# Altium schematic sheet PI2_Circuit.SchDoc
size Tabloid; Date: Date; Author: Author 1; Revision: 1; SheetNumber: 2; SheetTotal: 3; Size: 11x17; Sheet_Name: Circuit
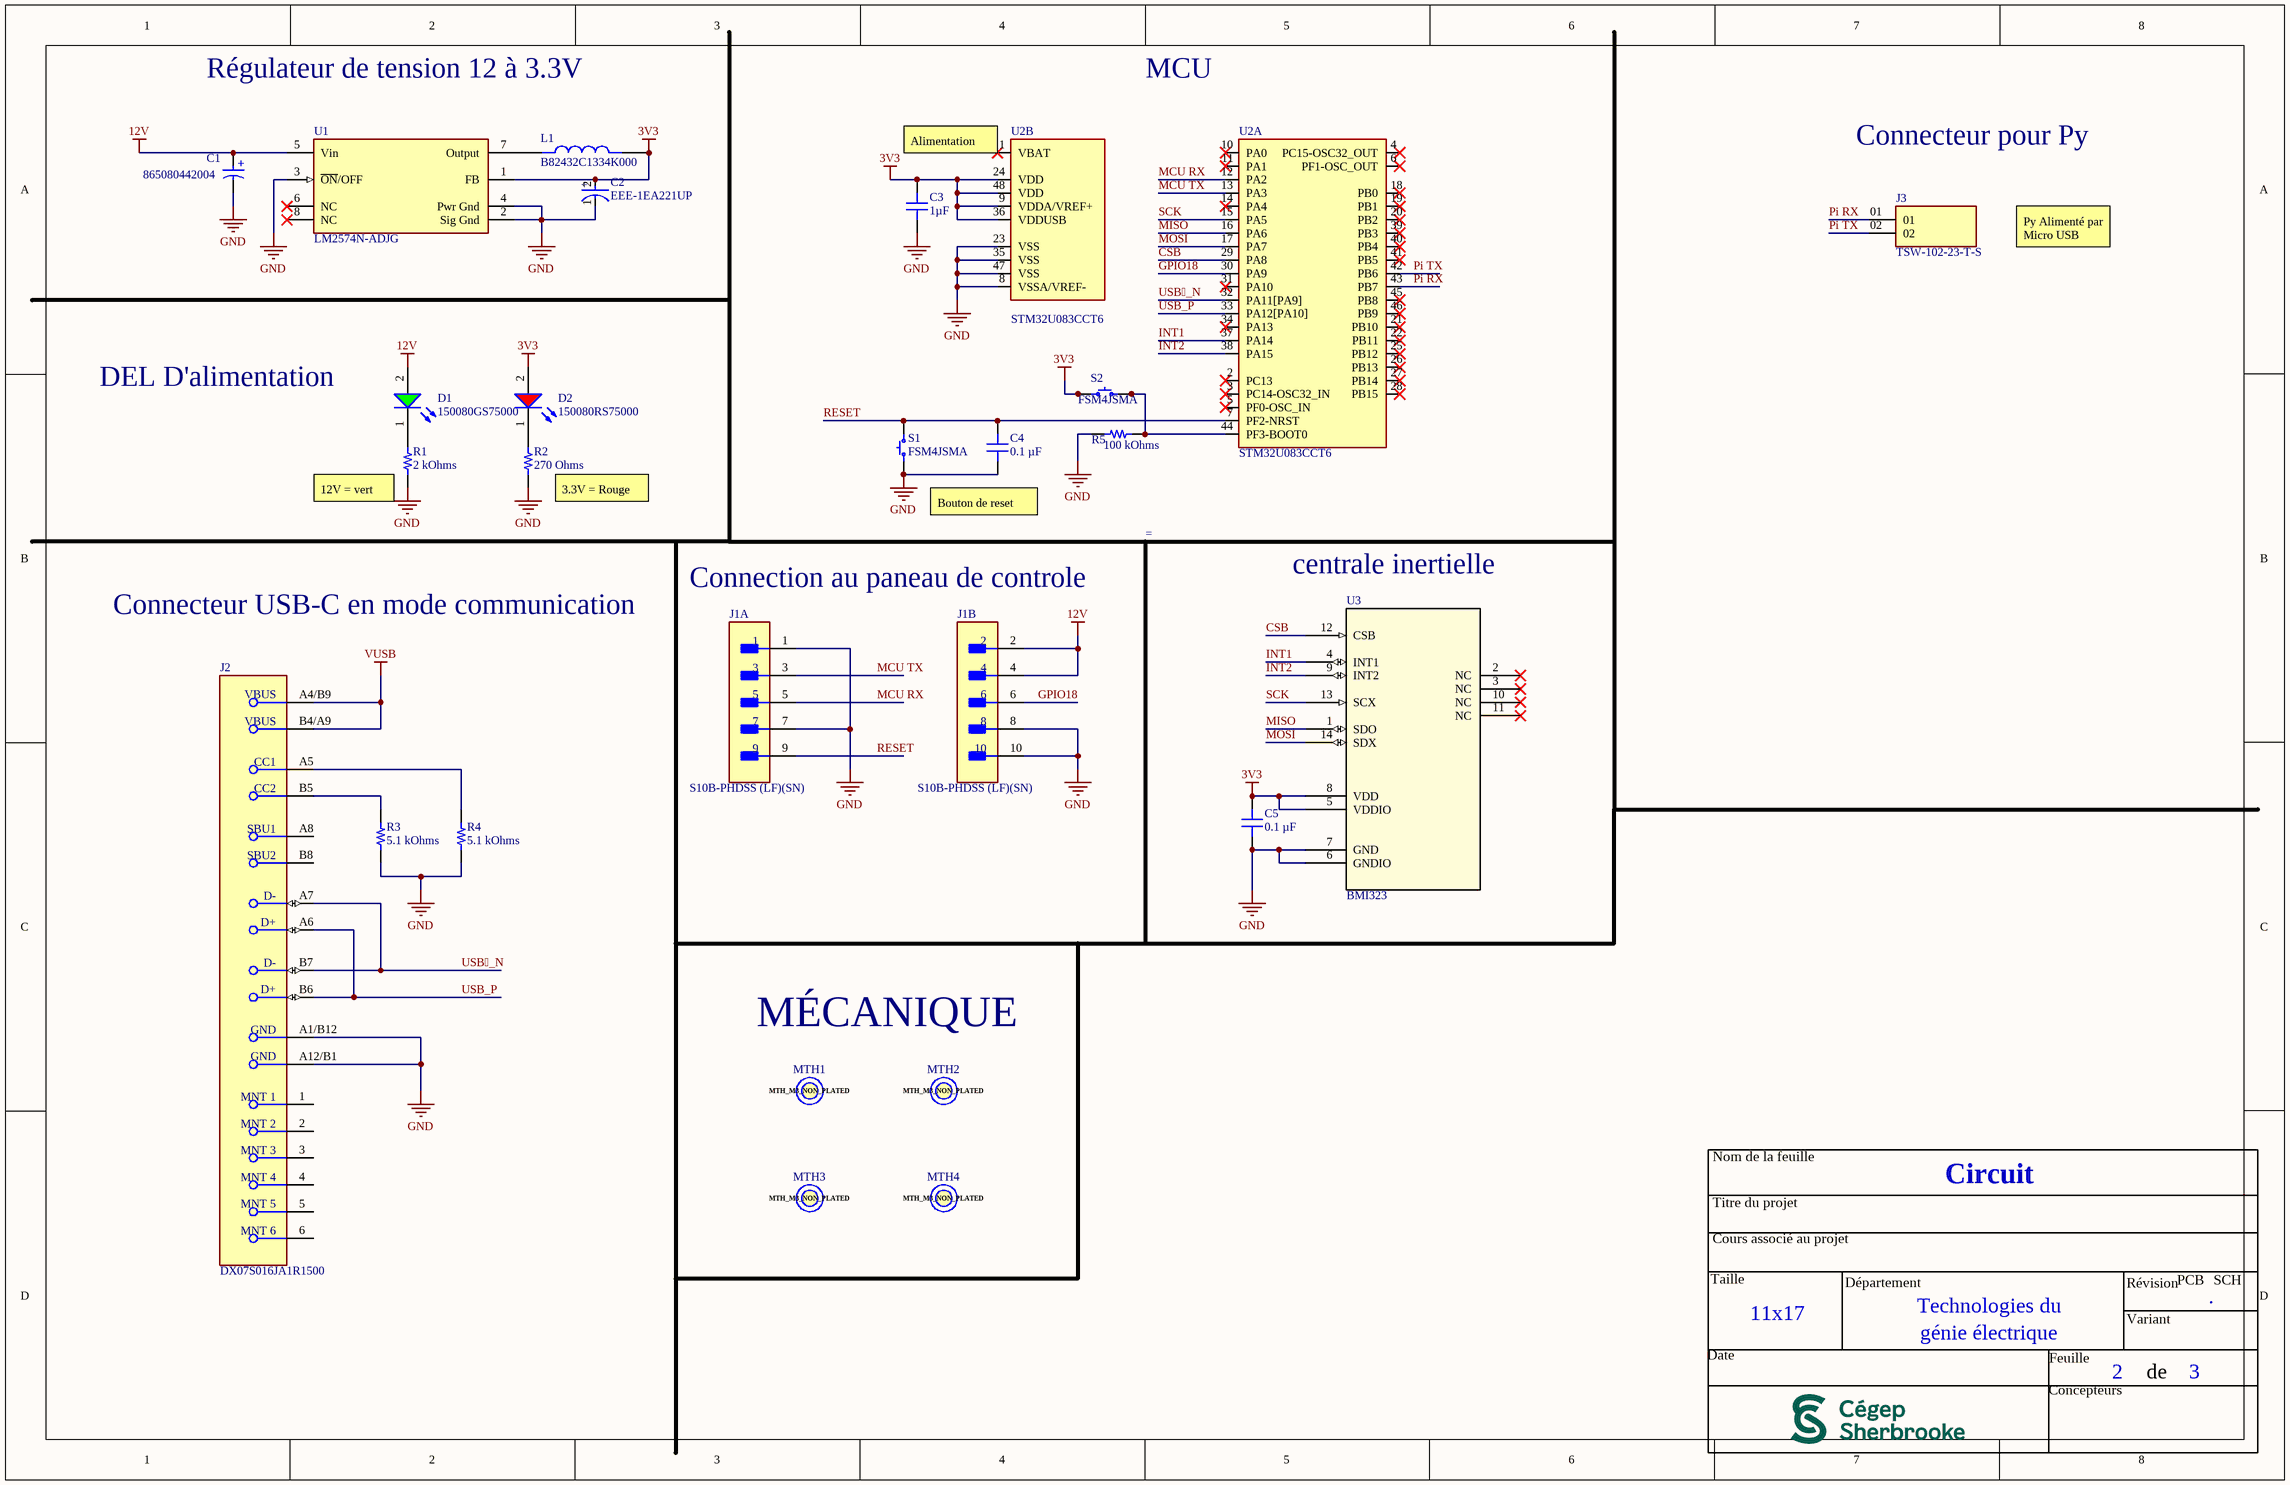
[diagram p0: PI2_Circuit.SchDoc]

## Parts
C1  865080442004  [WCAP-ASLI_D5H5.5]
C2  EEE-1EA221UP  [FP-SF-MFG]
C3  1µF  [CAP 0805_2012]
C4  0.1 µF  [CAP 0603_1608]
C5  0.1 µF  [CAP 0603_1608]
D1  150080GS75000  [WL-SMCW_0805_150080xx75000]
D2  150080RS75000  [WL-SMCW_0805_150080xx75000]
J1  S10B-PHDSS (LF)(SN)  [FP-S10B-PHDSS_LF_SN-MFG]  (parts A,B of 2)
J2  DX07S016JA1R1500  [FP-DX07S016JA1R1500-MFG]
J3  TSW-102-23-T-S  [SAMTEC_TSW-102-23-T-S]
L1  B82432C1334K000  [INDM4532X340N]
MTH1  MTH_M3_NON_PLATED  [MTH_M3_NON_PLATED]  (no BOM)
MTH2  MTH_M3_NON_PLATED  [MTH_M3_NON_PLATED]  (no BOM)
MTH3  MTH_M3_NON_PLATED  [MTH_M3_NON_PLATED]  (no BOM)
MTH4  MTH_M3_NON_PLATED  [MTH_M3_NON_PLATED]  (no BOM)
R1  2 kOhms  [RES 0603_1608]
R2  270 Ohms  [KOA RES RK73 RN73 0603_1608]
R3  5.1 kOhms  [YAGEO RES 0603_1608]
R4  5.1 kOhms  [YAGEO RES 0603_1608]
R5  value 100 kOhms  [RES 0603_1608]
S1  FSM4JSMA  [TE FSM4JSMA]
S2  FSM4JSMA  [TE FSM4JSMA]
U1  LM2574N-ADJG  [FP-626-05-MFG]
U2  STM32U083CCT6  [STM32U083CCT6-Footprint-1]  (parts A,B of 2)
U3  BMI323  [BMI323_BOS]

## Nets
3V3: C2.2(A) C3.2 C5.2 D2.2(A) L1.2 S2.1 S2.2 U1.1(FB) U2.9(VDDA/VREF+) U2.24(VDD) U2.36(VDDUSB) U2.48(VDD) U3.5(VDDIO) U3.8(VDD)
12V: C1.1(P) D1.2(A) J1.2 J1.4 U1.5(Vin)
GND: C1.2(N) C2.1(C) C3.1 C4.1 C5.1 J1.1 J1.7 J1.8 J1.10 J2.A1/B12(GND) J2.A12/B1(GND) R1.2 R2.2 R3.1 R4.1 R5.1 S1.1 S1.2 U1.2(Sig_Gnd) U1.3(~{ON}/OFF) U1.4(Pwr_Gnd) U2.8(VSSA/VREF-) U2.23(VSS) U2.35(VSS) U2.47(VSS) U3.6(GNDIO) U3.7(GND)
VUSB: J2.A4/B9(VBUS) J2.B4/A9(VBUS)
CSB: U2.29(PA8) U3.12(CSB)
GPIO18: J1.6 U2.30(PA9)
INT1: U2.37(PA14) U3.4(INT1)
INT2: U2.38(PA15) U3.9(INT2)
MCU RX: J1.5 U2.12(PA2)
MCU TX: J1.3 U2.13(PA3)
MISO: U2.16(PA6) U3.1(SDO)
MOSI: U2.17(PA7) U3.14(SDX)
Pi RX: J3.01 U2.43(PB7)
Pi TX: J3.02 U2.42(PB6)
RESET: C4.2 J1.9 S1.3 S1.4 U2.7(PF2-NRST)
SCK: U2.15(PA5) U3.13(SCX)
USB_N: J2.A7(D-) J2.B7(D-) U2.32(PA11[PA9])
USB_P: J2.A6(D+) J2.B6(D+) U2.33(PA12[PA10])
NetD1_1: D1.1(K) R1.1
NetD2_1: D2.1(K) R2.1
NetJ2_A5: J2.A5(CC1) R4.2
NetJ2_B5: J2.B5(CC2) R3.2
NetL1_1: L1.1 U1.7(Output)
NetR5_2: R5.2 S2.3 S2.4 U2.44(PF3-BOOT0)

Not connected (* = marked no-connect by the designer): J2 1(MNT_1) 2(MNT_2) 3(MNT_3) 4(MNT_4) 5(MNT_5) 6(MNT_6) A8(SBU1) B8(SBU2); U1 6(NC)* 8(NC)*; U2 1(VBAT)* 2(PC13)* 3(PC14-OSC32_IN)* 4(PC15-OSC32_OUT)* 5(PF0-OSC_IN)* 6(PF1-OSC_OUT)* 10(PA0)* 11(PA1)* 14(PA4)* 18(PB0)* 19(PB1)* 20(PB2)* 21(PB10)* 22(PB11)* 25(PB12)* 26(PB13)* 27(PB14)* 28(PB15)* 31(PA10)* 34(PA13)* 39(PB3)* 40(PB4)* 41(PB5)* 45(PB8)* 46(PB9)*; U3 2(NC)* 3(NC)* 10(NC)* 11(NC)*

## Notes on the sheet
- Régulateur de tension 12 à 3.3V
- MCU
- (near U2) Alimentation
- Connecteur pour Py
- Py Alimenté par Micro USB
- DEL D'alimentation
- (near R1) 12V = vert
- (near R2) 3.3V = Rouge
- Bouton de reset
- Connecteur USB-C en mode communication
- Connection au paneau de controle
- centrale inertielle
- MÉCANIQUE
- Nom de la feuille
- Titre du projet
- Cours associé au projet
- Taille
- Département
- Technologies du
- Révision
- PCB
- .
- SCH
- Date
- génie électrique
- Feuille
- Variant
- de
- Concepteurs
- (in symbol CMP-03913-53914587-2) +
- (in symbol CMP-05427-000064-1) +

## Library data of the parts
C1 = CMP-03913-53914587-2: WCAP-ASLI Aluminum Electrolytic Capacitors; Capacitance: 22µF; Leakage Current: 5.5µA; ESR (Equivalent Series Resistance): 942.169mΩ; Tolerance: 20%; Polarity: Polar; Ripple Current: 145mA; Voltage Rating (DC): 25V; Insulation Resistance: 4.54545MΩ; Life (Hours): 2000hours; Impedance: 1.2Ω; Case/Package: Radial; Diameter: 5mm; Height - Seated (Max): 5.5118mm; RoHS: Compliant; REACH SVHC: Unknown; Mount: Surface Mount; Ripple Current (AC): 145mA; Width: 5.3mm; Min Operating Temperature: -55°C; Voltage Rating: 25V; Max Operating Temperature: 105°C; Length: 5.5mm; Height: 5.5mm
C2 = CMP-05427-000064-1: CAP ALUM 220UF 20% 25V SMD; Life (Hours): 2000Hour; Leakage Current: 3uA; Ripple Current (AC): 230mA; Case/Package: Radial; Max Operating Temperature: 85°C; Voltage: 25V; Radiation Hardening: No; Construction: Cylindrical; Voltage Rating (DC): 25V; Package Quantity: 1; Series: S; Voltage Rating: 25V; Packaging: Tape and Reel; RoHS Compliant: Yes; Diameter: 8mm; Height: 10.2mm; Mount: Surface Mount; Termination: SMD/SMT; Contact Plating: Tin; Height - Seated (Max): 0.402inch; Capacitance: 220uF; Min Operating Temperature: -40°C; Length: 10.5mm; Ripple Current: 230mA; Tolerance: 20%; Lead Free: Lead Free
C3 = MM05ZC105KCZ2A: CAP CER 1UF 10V X7R 0805; manufacturer: AVX Corporation; Tolerance: ±10%; Part Number: MM05ZC105KCZ2A; Capacitance: 1µF; Applications: Medical, Non-Critical; componentlink1description: Datasheet; componentlink1url: http://datasheets.avx.com/AVX-MM.pdf; componentlink2description: DigiKey Link; componentlink2url: http://digikey.com/product-detail/en/avx-corporation/MM05ZC105KCZ2A/478-10611-1-ND/7344872; Device Package: 0805 (2012 Metric); lastupdated: 2020-09-02 01:04:42; Lifecycle Status: Active; Minimum Order: 1; Mounting Type: Surface Mount, MLCC; Operating Temperature: -55°C ~ 125°C; Package / Case: 0805 (2012 Metric); packaging: TapeAndReel; partid: 2439; Part Status: Active; price: 0.50; series: MM; Size / Dimension: 0.079" L x 0.049" W (2.01mm x 1.25mm); Supplier 1: DigiKey; Supplier Part Number 1: 478-10611-1-ND; Temperature Coefficient: X7R; Thickness (Max): 0.029" (0.74mm); value: 1µF; Voltage - Rated: 10V
C4 C5 = C0603C104K5RAC7411: CAP CER 0.1UF 50V X7R 0603; manufacturer: KEMET; Tolerance: ±10%; Part Number: C0603C104K5RAC7411; Capacitance: 0.1 µF; Applications: Bypass, Decoupling; componentlink1description: Datasheet; componentlink1url: https://api.kemet.com/component-edge/download/datasheet/C0603C104K5RAC7411.pdf; componentlink2description: DigiKey Link; componentlink2url: https://www.digikey.com/en/products/detail/kemet/C0603C104K5RAC7411/3317013; Device Package: 0603 (1608 Metric); lastupdated: 2024-02-09 20:10:30; Lifecycle Status: Active; Minimum Order: 1; Mounting Type: Surface Mount, MLCC; Operating Temperature: -55°C ~ 125°C; Package / Case: 0603 (1608 Metric); packaging: TapeAndReel; partid: 2233; Part Status: Active; price: 0.01; series: SMD Comm X7R; Size / Dimension: 0.063" L x 0.031" W (1.60mm x 0.80mm); Supplier 1: DigiKey; Supplier Part Number 1: 399-C0603C104K5RAC7411CT-ND; Temperature Coefficient: X7R; Thickness (Max): 0.035" (0.90mm); value: 0.1 µF; Voltage - Rated: 50V
D1 = CMP-1426-00007-3: WURTH ELEKTRONIK - 150080GS75000 - LED, Green, SMD, 0805, 30 mA, 3.2 V, 520 nm; Forward Voltage: 3.2V; Viewing Angle: 140°; Power Dissipation: 105mW; Peak Wavelength: 515nm; Max Reverse Voltage (DC): 5V; Luminous Intensity: 450mcd; Wavelength: 525nm; Max Junction Temperature (Tj): 95°C; Forward Current: 100mA; Test Current: 20mA; Lens Style: Clear, Rectangular; Length: 2mm; Case/Package: 0805; Case Code (Metric): 2012; Color: Green; Height: 700µm; Width: 1.25mm; Packaging: Tape and Reel; Mount: Surface Mount; REACH SVHC: Unknown; RoHS: Compliant; Min Operating Temperature: -40°C; Reverse Voltage: 5V; Max Operating Temperature: 85°C; Dominant Wavelength: 525nm; Case Code (Imperial): 0805
D2 = CMP-1426-00011-3: LED Uni-Color Red 630nm 2-Pin Chip 0805(2012Metric) T/R; Viewing Angle: 140°; Max Junction Temperature (Tj): 95°C; Power Dissipation: 72mW; Forward Current: 100mA; Forward Voltage: 2V; Wavelength: 625nm; Test Current: 20mA; Max Reverse Voltage (DC): 5V; Luminous Intensity: 150mcd; Lens Style: Clear, Rectangular; REACH SVHC: Unknown; Height: 700µm; Case Code (Metric): 2012; Peak Wavelength: 630nm; Length: 2mm; Width: 1.25mm; RoHS: Compliant; Packaging: Tape and Reel; Dominant Wavelength: 625nm; Color: Red; Case Code (Imperial): 0805; Min Operating Temperature: -40°C; Mount: Surface Mount; Max Operating Temperature: 85°C; Case/Package: 0805
J1 = CMP-17439-000374-2: CONN HEADER R/A 10POS 2MM; Number of Contacts: 10; Row Spacing: 0.079inch; Voltage Rating: 250V; Current Rating: 3A; Gender: Male; Contact Resistance: 20mR; Pitch: 2mm; Mount: Through Hole; Packaging: Bulk; Number of Rows: 2; Series: PHD; Depth: 9.5mm; Max Operating Temperature: 85°C; Number of Positions: 10; Connector Type: Header; Contact Plating: Copper; Contact Finish - Mating: TIN; Insulation Material: Nylon; Width: 5mm; Housing Color: Beige; Min Operating Temperature: -25°C; Flammability Rating: UL94 V-0; Termination: Solder; Contact Shape: Square; Color: Natural; Housing Material: Polyamide; Insulation Color: Natural; Contact Mating Length: 0.114inch; Length: 11.9mm; Height: 9.5mm; Lead Free: Lead Free; Contact Material: Copper Alloy; Orientation: Right Angle; Max Voltage Rating (AC): 250V; Contact Type: Male Pin; Max Current Rating: 3A; Fastening Type: Detent
J2 = CMP-19038-000003-1: CONN RCP USB2.0 TYP C 24P SMD RA
J3 = TSW-102-23-T-S: Connector Header Through Hole 2 position 0.100 (2.54mm); MF: Samtec; SnapEDA_Link: https://www.snapeda.com/parts/TSW-102-23-T-S/Samtec/view-part/4795093/?ref=snap; Price: None; Purchase-URL: https://pricing.snapeda.com/search/part/TSW-102-23-T-S/?ref=eda; Availability: Bad; Package: None; MP: TSW-102-23-T-S; Value: *
L1 = B82432C1334K000: INDUCTOR, 1812C, 330UH, 0.085A, 10%; Inductance: 330µH; Product Range: -; DC Current Rating: 85mA; Inductor Construction: Wirewound; DC Resistance Max: 14.1ohm; Inductance Tolerance: ± 10%; Self Resonant Frequency Min: 4.5MHz;; MF: TDK Electronics; SnapEDA_Link: https://www.snapeda.com/parts/B82432C1334K000/TDK/view-part/?ref=snap; Package: None; Value: *; MP: B82432C1334K000; Check_prices: https://www.snapeda.com/parts/B82432C1334K000/TDK/view-part/?ref=eda
MTH1-MTH4 = CMP-006-000010-2: MTH - MOUNTING HOLE M3 NON-PLATED - M3; Value: *; Component Type: Standard (No BOM); Package: M3; HelpURL: https://littlemachineshop.com/images/gallery/PDF/TapDrillSizes.pdf; Polarized: *; Pin Count: 0; Note: *; Assembly Type: NONE; Part Number #1: *; Source: CEGEP_SHERBROOKE_TGE_LIBRARY.SchLib; Design Item ID: MTH_M3_NON_PLATED; Power Max: *; Manufacturer #1: *
R1 = RMCF0603FT2K00: RES 2K OHM 1% 1/10W 0603; Manufacturer: Stackpole Electronics Inc; Power (Watts): 0.1W, 1/10W; Temperature Coefficient: ±100ppm/°C; Part Number: RMCF0603FT2K00; Value: 2 kOhms; ComponentLink1Description: Datasheet; ComponentLink1URL: https://www.seielect.com/catalog/sei-rmcf_rmcp.pdf; ComponentLink2Description: DigiKey Link; ComponentLink2URL: https://www.digikey.com/en/products/detail/stackpole-electronics-inc/RMCF0603FT2K00/1761334; Composition: Thick Film; Device Package: 0603 (1608 Metric); Features: Automotive AEC-Q200; Height - Seated (Max): 0.022" (0.55mm); LastUpdated: 2024-02-09 20:43:32; Lifecycle Status: Active; Minimum Order: 1; Number of Terminations: 2; Operating Temperature: -55°C ~ 155°C; Package / Case: 0603 (1608 Metric); Packaging: CutTape; PartId: 6085; Part Status: Active; Price: 0.01; Ratings: AEC-Q200; Resistance: 2 kOhms; Series: RMCF; Size / Dimension: 0.061" L x 0.031" W (1.55mm x 0.80mm); Supplier 1: DigiKey; Supplier Part Number 1: RMCF0603FT2K00CT-ND; Supplier Device Package: 0603; Tolerance: ±1%
R2 = RK73H1JTTD2700F: RES 270 OHM 1% 1/8W 0603; Manufacturer: KOA Speer Electronics, Inc.; Power (Watts): 0.125W, 1/8W; Temperature Coefficient: ±100ppm/°C; Part Number: RK73H1JTTD2700F; Value: 270 Ohms; ComponentLink1Description: Datasheet; ComponentLink1URL: http://www.koaspeer.com/catimages/Products/RK73H/RK73H.pdf; ComponentLink2Description: DigiKey Link; ComponentLink2URL: https://www.digikey.com/en/products/detail/koa-speer-electronics-inc/RK73H1JTTD2700F/9845010; Composition: Thick Film; Device Package: 0603 (1608 Metric); Features: Automotive AEC-Q200; Height - Seated (Max): 0.022" (0.55mm); LastUpdated: 2024-07-25 09:43:09; Lifecycle Status: Active; Minimum Order: 1; Number of Terminations: 2; Operating Temperature: -55°C ~ 155°C; Package / Case: 0603 (1608 Metric); Packaging: CutTape; PartId: 6149; Part Status: Active; Price: 0.01; Ratings: AEC-Q200; Resistance: 270 Ohms; Series: RK73H; Size / Dimension: 0.063" L x 0.031" W (1.60mm x 0.80mm); Supplier 1: DigiKey; Supplier Part Number 1: 2019-RK73H1JTTD2700FCT-ND; Supplier Device Package: 0603; Tolerance: ±1%
R3 R4 = AC0603FR-075K1L: RES SMD 5.1K OHM 1% 1/10W 0603; Manufacturer: Yageo; Power (Watts): 0.1W, 1/10W; Temperature Coefficient: ±100ppm/°C; Part Number: AC0603FR-075K1L; Value: 5.1 kOhms; ComponentLink1Description: Datasheet; ComponentLink1URL: https://www.yageo.com/upload/media/product/productsearch/datasheet/rchip/PYu-AC_51_RoHS_L_7.pdf; ComponentLink2Description: DigiKey Link; ComponentLink2URL: https://www.digikey.com/en/products/detail/yageo/AC0603FR-075K1L/5896209; Composition: Thick Film; Device Package: 0603 (1608 Metric); Features: Automotive AEC-Q200, Moisture Resistant; Height - Seated (Max): 0.022" (0.55mm); LastUpdated: 2024-07-25 09:19:23; Lifecycle Status: Active; Minimum Order: 1; Number of Terminations: 2; Operating Temperature: -55°C ~ 155°C; Package / Case: 0603 (1608 Metric); Packaging: CutTape; PartId: 17442; Part Status: Active; Price: 0.01; Ratings: AEC-Q200; Resistance: 5.1 kOhms; Series: AC; Size / Dimension: 0.063" L x 0.031" W (1.60mm x 0.80mm); Supplier 1: DigiKey; Supplier Part Number 1: YAG3621CT-ND; Supplier Device Package: 0603; Tolerance: ±1%
  R3: Parameter 1: *; ComponentLink3Description: New link; ComponentLink3URL: *
R5 = RCS0603100KFKEA: RES SMD 100K OHM 1% 1/4W 0603; Part Number: RCS0603100KFKEA
S1 S2 = FSM4JSMA: SWITCH TACTILE SPST-NO 0.05A 24V; Manufacturer: TE Connectivity ALCOSWITCH Switches; Actuator Height off PCB, Vertical: 5.00mm; Actuator Orientation: Top Actuated; Actuator Type: Standard; Contact Rating @ Voltage: 0.05A @ 24VDC; Illumination: Non-Illuminated; Operating Force: 160gf; Outline: 6.00mm x 6.00mm; Switch Function: Off-Mom; Part Number: FSM4JSMA; Circuit: SPST-NO; ComponentLink1Description: Datasheet; ComponentLink1URL: https://www.te.com/commerce/DocumentDelivery/DDEController?Action=srchrtrv&DocNm=1308111-1_SWITCHES_CORE_PROGRAM_CATALOG&DocType=CS&DocLang=English; ComponentLink2Description: DigiKey Link; ComponentLink2URL: https://www.digikey.com/en/products/detail/te-connectivity-alcoswitch-switches/FSM4JSMA/525821; LastUpdated: 2024-06-03 20:19:31; Lifecycle Status: Active; Minimum Order: 1; Mounting Type: Surface Mount; Operating Temperature: -35°C ~ 85°C; Packaging: Bulk; Part Status: Active; Price: 0.14; Series: FSMJSMA; Supplier 1: DigiKey; Supplier Part Number 1: 450-1129-ND; Termination Style: Gull Wing
U1 = CMP-00278-46513304-1: LM2574N-ADJG Buck Regulator, Switching, Adjustable Output Voltage, 0.5 A Adjustable 1.23 V to 37 V; Manufacturer Lifecycle Status: ACTIVE; Min Output Voltage: 1.23V; Quiescent Current: 9mA; Operating Supply Voltage: 40V; Switching Frequency: 52kHz; Max Duty Cycle: 98%; Number of Outputs: 1; Efficiency: 77%; Max Output Voltage: 37V; Synchronous Rectifier: No; Output Current: 500mA; Min Input Voltage: 4.75V; REACH SVHC: No SVHC; RoHS: Compliant; Lead Free: Lead Free; Max Input Voltage: 40V; Max Operating Temperature: 125°C; Width: 6.6mm; Case/Package: PDIP; Schedule B: 8542390000, 8542390000; Frequency: 52kHz; Output Type: Adjustable; Radiation Hardening: No; Number of Pins: 8; NexarPartId: 46513304; Min Operating Temperature: -40°C; Lifecycle Status: Production; Mount: Through Hole; Max Output Current: 500mA; Height: 3.44mm; Length: 10.16mm; Number of Channels: 1; Output Voltage: 37V
U2 = CMP-005-000031-1: MCU 32-bit ARM Cortex M0+ RISC 256KB Flash 2.5V/3.3V 48-Pin LQFP Tray
U3 = BMI323: Description; Manufacturer_Name: Bosch Sensortec; Copyright: Copyright (C) 2026 Ultra Librarian. All rights reserved.; Manufacturer_Part_Number: BMI323; RefDes: RefDes; Type: Type